# EAGLE design Medir-220-2 (EAGLE 7.2.0)
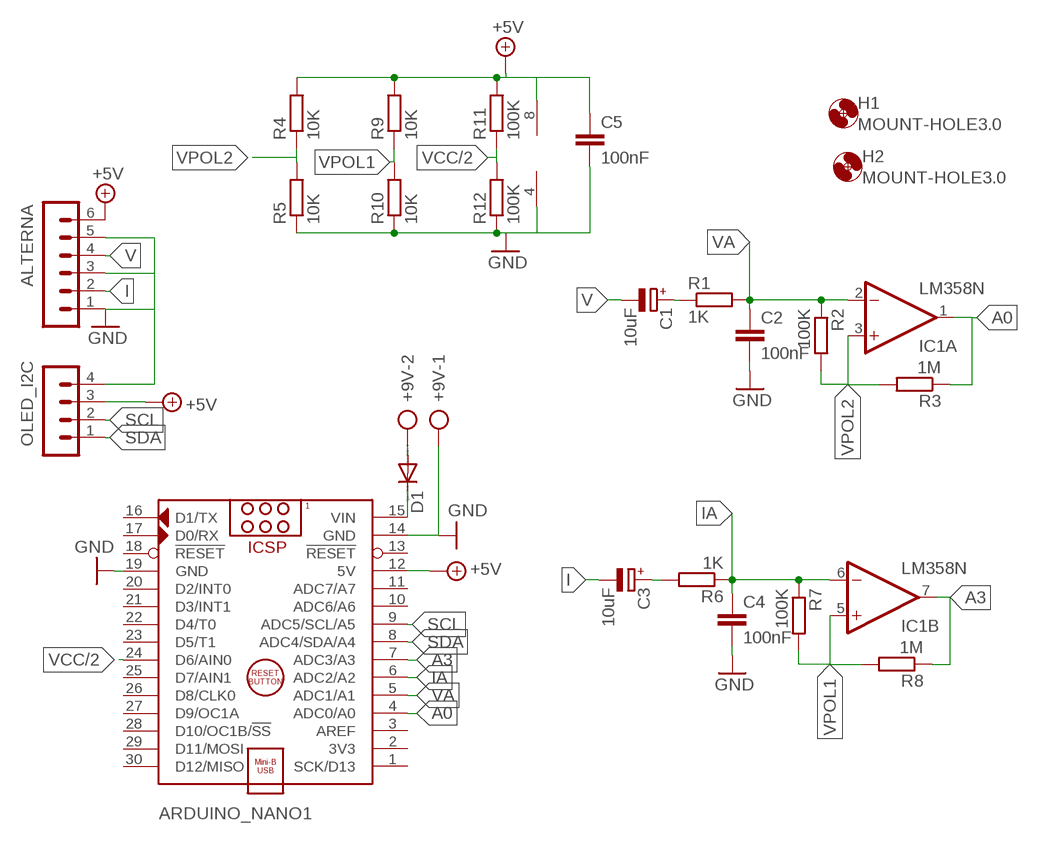
[diagram p0: schematic, sheet 1]

## Parts
+9V  AK500/2  [AK500/2]
ALTERNA  MA06-1  [MA06-1]
ARDUINO_NANO1  ARDUINO_NANO  [ARDUINO_NANO]
C1  10uF  CPOL-EUE2.5-5  [E2,5-5]
C2  100nF  C-EU050-025X075  [C050-025X075]
C3  10uF  CPOL-EUE2.5-5  [E2,5-5]
C4  100nF  C-EU050-025X075  [C050-025X075]
C5  100nF  C-EU025-025X050  [C025-025X050]
D1  DIODE-D-2.5  [D-2.5]
H1  MOUNT-HOLE3.0  [3,0]
H2  MOUNT-HOLE3.0  [3,0]
IC1  LM358N  [DIL08]
OLED_I2C  MA04-1  [MA04-1]
R1  1K  R-EU_0207/7  [0207/7]
R2  100K  R-EU_0207/7  [0207/7]
R3  1M  R-EU_0207/7  [0207/7]
R4  10K  R-EU_0207/10  [0207/10]
R5  10K  R-EU_0207/7  [0207/7]
R6  1K  R-EU_0207/7  [0207/7]
R7  100K  R-EU_0207/7  [0207/7]
R8  1M  R-EU_0207/7  [0207/7]
R9  10K  R-EU_0207/7  [0207/7]
R10  10K  R-EU_0207/7  [0207/7]
R11  100K  R-EU_0207/10  [0207/10]
R12  100K  R-EU_0207/10  [0207/10]

## Nets
+5V: ALTERNA.6 ARDUINO_NANO1.12(5V) C5.1 IC1.8(P:V+) OLED_I2C.3 R4.2 R9.2 R11.2
A0: ARDUINO_NANO1.4(ADC0/A0) IC1.1(A:OUT) R3.1
A3: ARDUINO_NANO1.7(ADC3/A3) IC1.7(B:OUT) R8.1
GND: +9V.1 ALTERNA.1 ALTERNA.3 ALTERNA.5 ARDUINO_NANO1.14(GND) ARDUINO_NANO1.19(GND) C2.2 C4.2 C5.2 IC1.4(P:V-) OLED_I2C.4 R5.1 R10.1 R12.1
I: ALTERNA.2 C3.-
IA: ARDUINO_NANO1.6(ADC2/A2) C4.1 IC1.6(B:-IN) R6.1 R7.1
N$1: C1.+ R1.1
N$2: C3.+ R6.2
N$3: +9V.2 D1.A
N$5: ARDUINO_NANO1.15(VIN) D1.C
SCL: ARDUINO_NANO1.9(ADC5/SCL/A5) OLED_I2C.2
SDA: ARDUINO_NANO1.8(ADC4/SDA/A4) OLED_I2C.1
V: ALTERNA.4 C1.-
VA: ARDUINO_NANO1.5(ADC1/A1) C2.1 IC1.2(A:-IN) R1.2 R2.1
VCC/2: ARDUINO_NANO1.24(D6/AIN0) R11.1 R12.2
VPOL1: IC1.5(B:+IN) R7.2 R8.2 R9.1 R10.2
VPOL2: IC1.3(A:+IN) R2.2 R3.2 R4.1 R5.2
Unconnected: ARDUINO_NANO1.1(SCK/D13) ARDUINO_NANO1.2(3V3) ARDUINO_NANO1.3(AREF) ARDUINO_NANO1.10(ADC6/A6) ARDUINO_NANO1.11(ADC7/A7) ARDUINO_NANO1.13(!RESET) ARDUINO_NANO1.16(D1/TX) ARDUINO_NANO1.17(D0/RX) ARDUINO_NANO1.18(!RESET) ARDUINO_NANO1.20(D2/INT0) ARDUINO_NANO1.21(D3/INT1) ARDUINO_NANO1.22(D4/T0) ARDUINO_NANO1.23(D5/T1) ARDUINO_NANO1.25(D7/AIN1) ARDUINO_NANO1.26(D8/CLK0) ARDUINO_NANO1.27(D9/OC1A) ARDUINO_NANO1.28(D10/OC1B/!SS) ARDUINO_NANO1.29(D11/MOSI) ARDUINO_NANO1.30(D12/MISO)

## Library data of the parts
+9V = con-ptr500:AK500/2: CONNECTOR; OC_FARNELL: unknown; OC_NEWARK: unknown
ALTERNA = con-lstb:MA06-1: PIN HEADER; OC_FARNELL: unknown; OC_NEWARK: unknown
ARDUINO_NANO1 = ArduinoNanoV30:ARDUINO_NANO: Arduino Nano V3.0 Module Overview: The Arduino Nano is a small, complete, and breadboard-friendly board based on the ATmega328 (Arduino Nano 3.x) or ATmega168 (Arduino Nano 2.x). It has more or less the same functionality of the Arduino Duemilanove, but in a different package. It lacks only a DC power jack, and works with a Mini-B USB cable instead of a standard one. The Nano was designed and is being produced by Gravitech <http://www.gravitech.us/arna30wiatp.html>. General specifications: Item Value Microcontroller Atmel ATmega168 or ATmega328 Operating Voltage (logic level) 5 V Input Voltage (recommended) 7-12 V Input Voltage (limits) 6-20 V Digital I/O Pins 14 (of which 6 provide PWM output) Analog Input Pins 8 DC Current per I/O Pin 40 mA Flash Memory 16 KB (ATmega168) or 32 KB (ATmega328) of which 2 KB used by bootloader SRAM 1 KB (ATmega168) or 2 KB (ATmega328) EEPROM 512 bytes (ATmega168) or 1 KB (ATmega328) Clock Speed 16 MHz Dimensions (Inches) 0.73" x 1.70" Dimensions (mm) 18mm x 45mm Overall height About 9 mm (not including pins) Weigth 5 g Power: The Arduino Nano can be powered via the Mini-B USB connection, 6-20V unregulated external power supply (pin 30), or 5V regulated external power supply (pin 27). The power source is automatically selected to the highest voltage source. Memory: The ATmega168 has 16 KB of flash memory for storing code (of which 2 KB is used for the bootloader); the ATmega328 has 32 KB, (also with 2 KB used for the bootloader). The ATmega168 has 1 KB of SRAM and 512 bytes of EEPROM (which can be read and written with the EEPROM library); the ATmega328 has 2 KB of SRAM and 1 KB of EEPROM. Input and Output: Each of the 14 digital pins on the Nano can be used as an input or output, using pinMode(), digitalWrite(), and digitalRead() functions. They operate at 5 volts. Each pin can provide or receive a maximum of 40 mA and has an internal pull-up resistor (disconnected by default) of 20-50 kOhms. In addition, some pins have specialized functions. Visit Arduino - ArduinoBoardNano <https://www.arduino.cc/en/Main/ArduinoBoardNano>
C1 C3 = rcl:CPOL-EU: POLARIZED CAPACITOR, European symbol
C2 C4 C5 = rcl:C-EU: CAPACITOR, European symbol
D1 = diode:DIODE-: DIODE
H1 H2 = holes:MOUNT-HOLE: MOUNTING HOLE with drill center marker
IC1 = linear:LM358: OP AMP also LM158; LM258; LM2904 Source: http://cache.national.com/ds/LM/LM158.pdf
OLED_I2C = con-lstb:MA04-1: PIN HEADER; OC_FARNELL: unknown; OC_NEWARK: unknown
R1-R12 = resistor:R-EU_: RESISTOR, European symbol

## Board
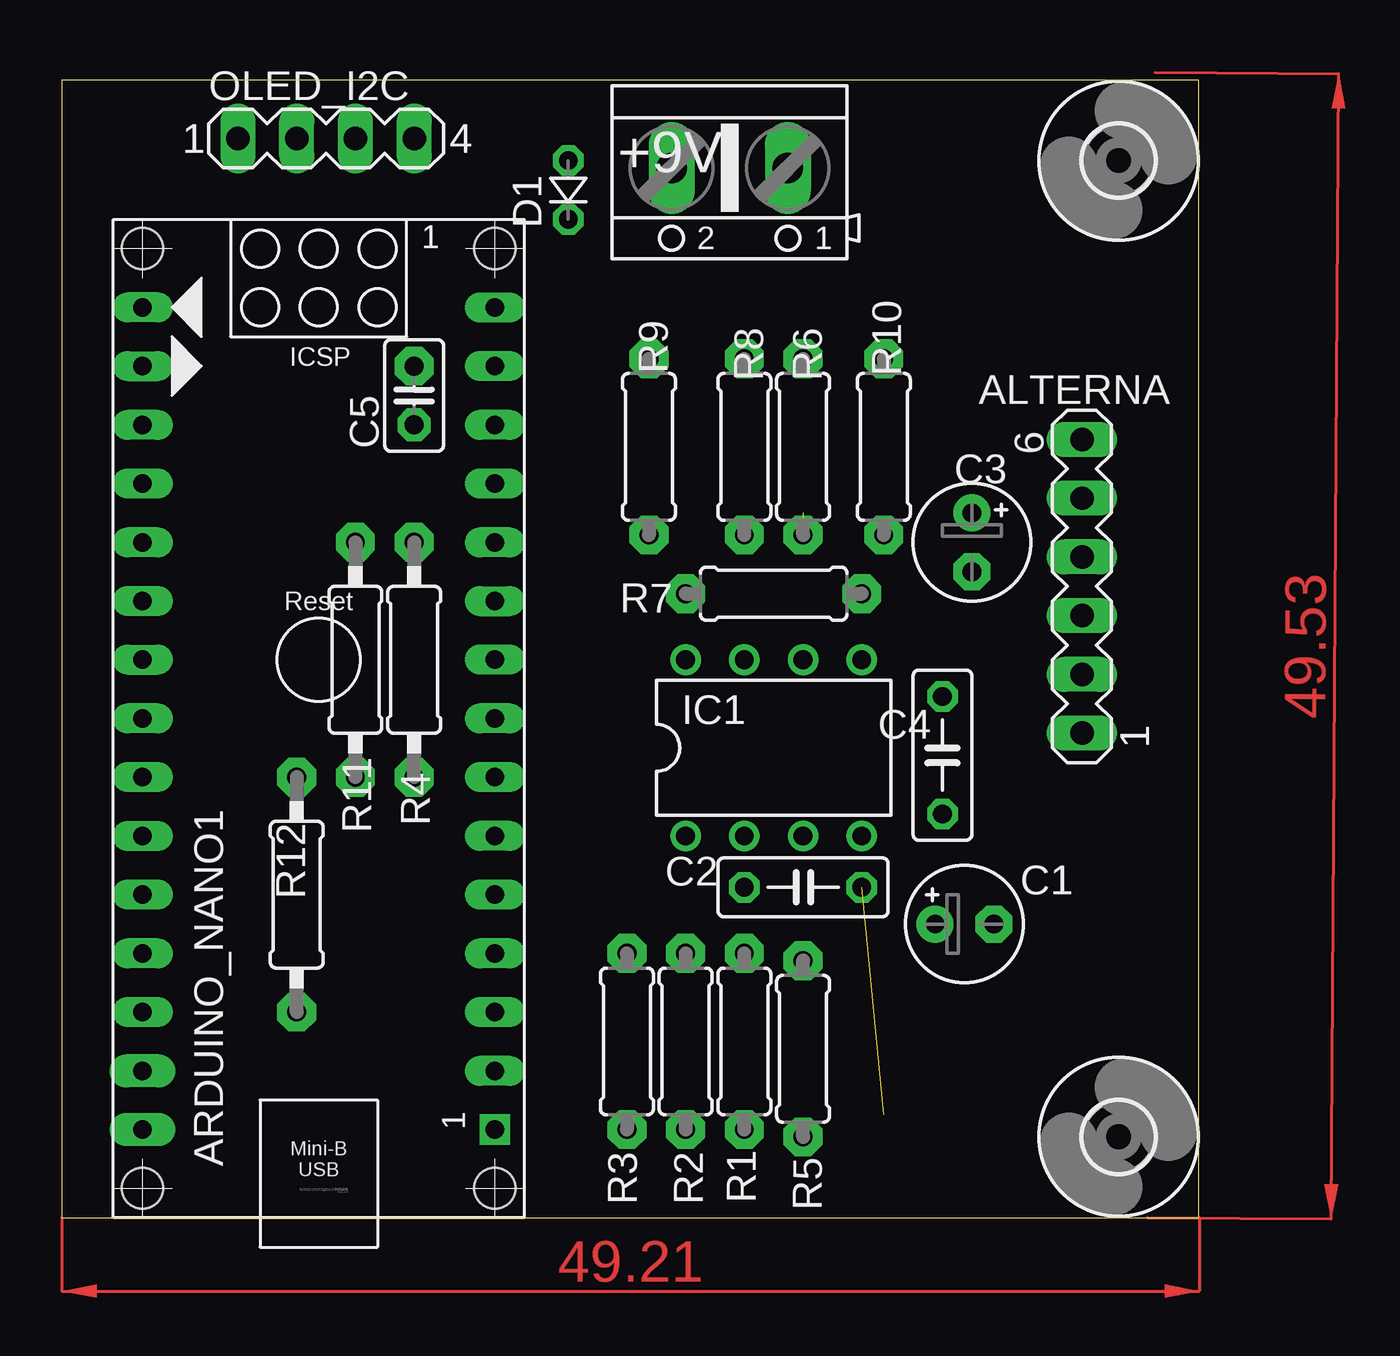
[diagram p1: board, top side]
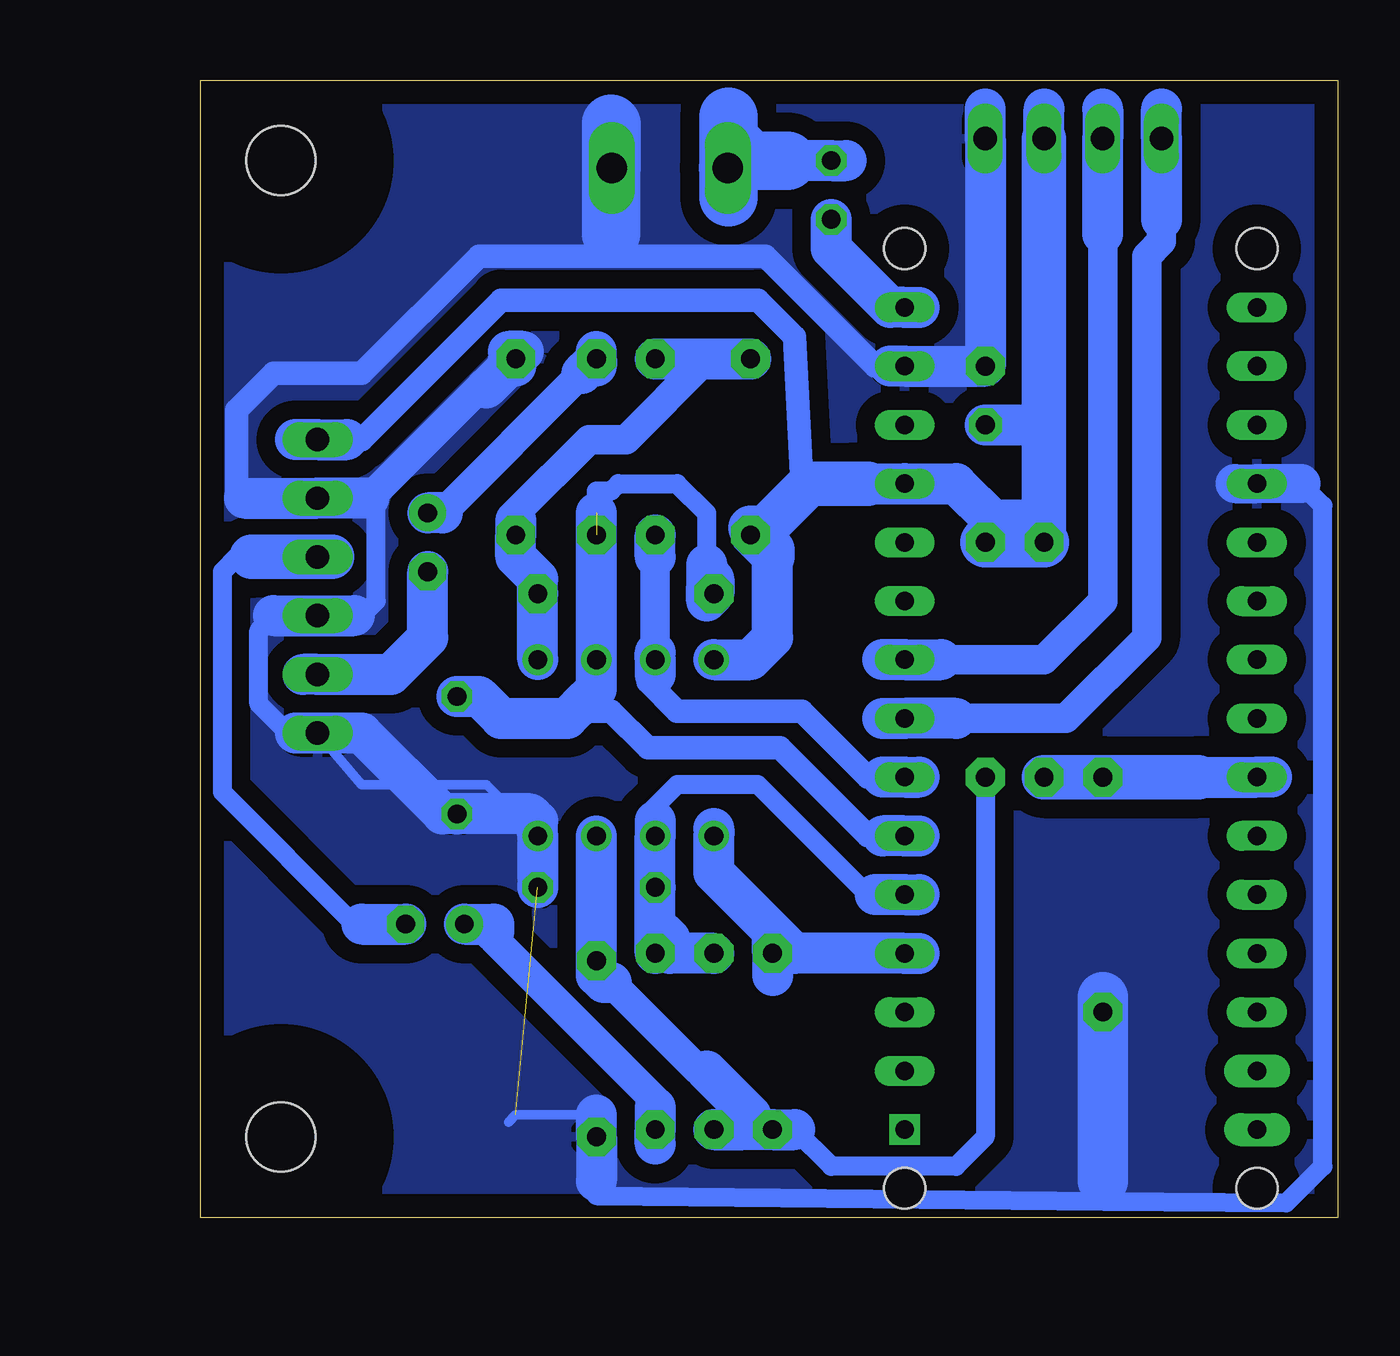
[diagram p2: board, bottom side, seen from below]

Size 49.2 x 49.2 mm. Coordinates in mm from the lower left corner, seen from the top.
Outline: 0,0 49.2,0 49.2,49.2 0,49.2 0,0
Copper layers (1*16): Top 0.035mm / dielectric 1.5mm / Bottom 0.035mm
Design rules "default": minimum track width 10mil, minimum drill 24mil, track to track 8mil, track to pad 8mil, pad to pad 8mil, via to via 8mil, smd to smd 8mil, copper to edge 40mil, drill to drill 8mil, minimum pad ring 10mil, minimum via ring 8mil, stop-mask expansion 4mil, vias tented up to drill 0mil, thermal gap 10mil

### Footprints (pad centres in the part's own frame; a part is rotated, then mirrored left to right if it is on the bottom)
AK500/2 = drill 1.321 long: 1 -2.515,0; 2 2.515,0
MA06-1 = drill 1.016 long: 1 -6.35,0; 2 -3.81,0; 3 -1.27,0; 4 1.27,0; 5 3.81,0; 6 6.35,0
ARDUINO_NANO = drill 0.8 pad 1.27 square: 1 -20.32,-7.62 | drill 0.8 long: 2 -17.78,-7.62; 3 -15.24,-7.62; 4 -12.7,-7.62; 5 -10.16,-7.62; 6 -7.62,-7.62; 7 -5.08,-7.62; 8 -2.54,-7.62; 9 0,-7.62; 10 2.54,-7.62; 11 5.08,-7.62; 12 7.62,-7.62; 13 10.16,-7.62; 14 12.7,-7.62; 15 15.24,-7.62; 16 15.24,7.62; 17 12.7,7.62; 18 10.16,7.62; 19 7.62,7.62; 20 5.08,7.62; 21 2.54,7.62; 22 0,7.62; 23 -2.54,7.62; 24 -5.08,7.62; 25 -7.62,7.62; 26 -10.16,7.62; 27 -12.7,7.62; 28 -15.24,7.62 | drill 0.8 pad 1.422 long: 29 -17.78,7.62; 30 -20.32,7.62 | hole 1.778: -22.86,-7.62; -22.86,7.62; 17.78,7.62; 17.78,-7.62
E2,5-5 = drill 0.813 pad 1.6: + -1.27,0 | drill 0.813 pad 1.6 octagon: - 1.27,0
C050-025X075 = drill 0.813 octagon: 1 -2.54,0; 2 2.54,0
C025-025X050 = drill 0.813 pad 1.422 octagon: 1 -1.27,0 | drill 0.813 pad 1.676 octagon: 2 1.27,0
D-2.5 = drill 0.813 octagon: A 1.27,0; C -1.27,0
3,0 = hole 3: 0,0
DIL08 = drill 0.813 pad 1.27: 1 -3.81,-3.81; 2 -1.27,-3.81; 3 1.27,-3.81; 4 3.81,-3.81; 5 3.81,3.81; 6 1.27,3.81; 7 -1.27,3.81; 8 -3.81,3.81
MA04-1 = drill 1.016 long: 1 -3.81,0; 2 -1.27,0; 3 1.27,0; 4 3.81,0
0207/7 = drill 0.813 pad 1.676 octagon: 1 -3.81,0; 2 3.81,0
0207/10 = drill 0.813 pad 1.676 octagon: 1 -5.08,0; 2 5.08,0

### Placement (x,y rotation side)
+9V  28.89,45.4 180 top
ALTERNA  44.13,27.3 90 top
ARDUINO_NANO1  11.11,24.13 90 top
C1  39.05,12.7 0 top
C2  32.07,14.29 0 top
C3  39.37,29.21 270 top
C4  38.1,20 270 top
C5  15.24,35.56 90 top
D1  21.91,44.45 90 top
H1  45.72,3.49 0 top
H2  45.72,45.72 0 top
IC1  30.8,20.32 0 top
OLED_I2C  11.43,46.67 0 top
R1  29.53,7.62 90 top
R2  26.99,7.62 270 top
R3  24.45,7.62 270 top
R4  15.24,24.13 90 top
R5  32.07,7.3 90 top
R6  32.07,33.34 90 top
R7  30.8,26.99 0 top
R8  29.53,33.34 90 top
R9  25.4,33.34 270 top
R10  35.56,33.34 270 top
R11  12.7,24.13 90 top
R12  10.16,13.97 90 top

### Tracks (layer width: path | path; a pad name or v marks a point on that pad's centre or on a via)
+5V
  Bottom 1.016: 42.86,33.66 42.23,33.66 36.2,39.69 25.08,39.69 23.5,38.1 23.18,31.75 20.95,31.75
  Bottom 1.778: 14.92,30.16 16.51,31.75 ARDUINO_NANO1.12 20.32,31.75 | 14.92,30.16 13.97,29.21 | IC1.8 25.4,24.13 24.45,25.08 24.45,28.57 R9.2 | 45.09,33.66 ALTERNA.6 42.86,33.66 | OLED_I2C.3 12.7,47.94 | 12.7,30.8 13.34,30.16 14.92,30.16 | C5.1 12.7,34.29
  Bottom 1.93: R11.2 12.7,34.29 OLED_I2C.3 | 24.45,28.57 24.45,28.89 25.4,29.85 24.77,29.85 22.86,31.75 20.95,31.75 20.32,31.75
  Bottom 2.184: R11.2 13.97,29.21 R4.2
A0
  Bottom 1.778: 24.45,10.48 R3.1 24.45,12.38 | 24.45,12.38 26.99,14.92 IC1.1 26.99,16.83 | 18.1,11.43 ARDUINO_NANO1.4 23.5,11.43 24.45,12.38
A3
  Bottom 1.016: 19.68,19.05 20.32,19.05 23.18,21.91 28.57,21.91 29.84,23.18 29.84,23.81 IC1.7
  Bottom 1.27: 29.53,24.45 29.53,28.57
  Bottom 1.778: 29.53,23.5 IC1.7 29.53,24.45 | 29.53,28.57 R8.1 | 18.1,19.05 ARDUINO_NANO1.7 19.68,19.05
GND  (1 unrouted)
  Bottom 0.406: IC1.4 36.83,18.73 42.23,18.73 ALTERNA.1 | 32.07,4.45 35.56,4.45 35.88,4.13
  Bottom 0.813: 32.07,1.59 32.07,0.95 10.17,0.72 | 10.17,0.72 2.22,0.64 0.64,2.22 0.64,30.8 1.59,31.75 | 45.09,20.96 45.4,20.96 46.67,22.23 46.67,25.4 46.04,26.04 | 42.55,26.04 42.23,26.04 41.59,26.67 41.59,30.8 41.91,31.11 | 10.16,1.59 10.16,0.73 10.17,0.72
  Bottom 1.016: 19.37,36.83 20,36.83 24.77,41.59 31.11,41.59 | 31.11,41.59 37.15,41.59 42.23,36.51 46.04,36.51 47.62,34.92 47.62,31.43 47.31,31.11 | 31.43,42.54 31.43,41.91 31.11,41.59
  Bottom 1.27: 36.83,35.88 37.15,35.88 41.91,31.11
  Bottom 1.676: 1.59,31.75 ARDUINO_NANO1.19 4.45,31.75
  Bottom 1.778: C2.2 IC1.4 34.61,17.14 34.92,17.46 C4.2 38.73,17.46 42.23,20.96 ALTERNA.1 45.09,20.96 | 46.04,26.04 42.55,26.04 | 41.91,31.11 ALTERNA.5 47.31,31.11 | R10.1 35.24,37.46 35.88,37.46 35.88,37.15 35.56,36.83 35.88,36.83 36.83,35.88 | 32.07,4.45 R5.1 32.07,1.59 | 15.24,47.94 OLED_I2C.4 C5.2 ARDUINO_NANO1.14 19.37,36.83
  Bottom 2.184: 10.16,9.53 R12.1 10.16,1.59
  Bottom 2.54: +9V.1 31.41,47.28 31.43,47.31 31.43,42.54
  pour Bottom (isolate 0.813): 0,0 0,49.21 49.21,49.21 49.21,48.58 49.21,0
I
  Bottom 1.778: 44.77,23.5 ALTERNA.2 40.96,23.5 39.37,25.08 C3.-
IA  (1 unrouted)
  Bottom 0.813: 32.07,30.48 32.07,31.43 31.43,31.43 31.11,31.75 28.57,31.75 27.3,30.48 27.3,28.26
  Bottom 1.016: 19.68,16.51 20.32,16.51 24.13,20.32 29.84,20.32 31.43,21.91 32.7,21.91 32.86,22.07
  Bottom 1.778: C4.1 37.15,22.54 36.2,21.59 33.34,21.59 32.86,22.07 32.07,22.86 IC1.6 32.07,30.48 | 27.3,28.26 27.3,27.94 | 27.3,27.94 26.99,27.62 R7.1 | R7.1 27.3,26.67 27.3,27.3 | 27.3,27.94 27.3,27.3 | 27.3,27.3 R7.1 | 18.1,16.51 ARDUINO_NANO1.6 19.68,16.51
N$1
  Bottom 1.27: 36.51,12.38 36.51,12.06 29.53,5.08 29.53,4.76
  Bottom 1.778: C1.+ 36.51,12.7 36.51,12.38 | 29.53,4.76 R1.1 29.53,3.18
N$2
  Bottom 1.27: 32.7,36.51 38.73,30.48
  Bottom 1.778: 32.07,37.46 R6.2 32.07,36.83 32.38,36.83 32.7,36.51 | 38.73,30.48 C3.+
N$3
  Bottom 1.778: 21.27,45.72 D1.A 23.81,45.72
  Bottom 2.54: 23.81,45.72 25.4,45.72 26.35,46.67 | 26.35,46.67 26.35,47.62 | 26.35,46.67 26.35,45.38 | 26.35,44.13 26.35,45.38 | 26.35,45.38 +9V.2
N$5
  Bottom 1.778: 18.1,39.37 ARDUINO_NANO1.15 19.37,39.37 21.91,41.91 D1.C
SCL
  Bottom 1.27: 17.14,24.13 12.7,24.13 10.16,26.67 10.16,42.54
  Bottom 1.778: 19.68,24.13 ARDUINO_NANO1.9 17.14,24.13 | 10.16,42.54 OLED_I2C.2 10.16,47.94
SDA
  Bottom 1.27: 7.62,43.18 7.62,42.23 8.26,41.59 8.26,25.08 11.75,21.59 16.51,21.59
  Bottom 1.778: 7.62,47.94 OLED_I2C.1 7.62,43.18 | 16.51,21.59 ARDUINO_NANO1.8 19.68,21.59
V
  Bottom 0.813: 46.99,28.57 47.62,28.57 48.26,27.94 48.26,18.42 42.55,12.7 42.23,12.7
  Bottom 1.778: 42.23,12.7 C1.-
  Bottom 1.93: 43.5,28.57 ALTERNA.4 46.99,28.57
VA
  Bottom 0.813: 20,13.97 20.32,13.97 25.08,18.73 28.57,18.73 29.84,17.46 29.53,17.14
  Bottom 1.778: R1.2 29.53,12.7 | 29.53,12.7 C2.1 IC1.2 29.53,17.14 | R2.1 28.89,11.43 28.89,12.06 29.53,12.7 | 18.1,13.97 ARDUINO_NANO1.5 20,13.97
VCC/2
  Bottom 1.778: 6.03,19.05 ARDUINO_NANO1.24 2.86,19.05
  Bottom 1.93: R11.1 R12.2 6.03,19.05
VPOL1
  Bottom 1.27: 35.56,30.16 35.56,30.48 32.38,33.66 30.8,33.66 27.3,37.15
  Bottom 1.778: IC1.5 R7.2 34.61,27.62 35.56,28.57 R10.2 35.56,30.16 | R8.2 27.3,37.15 R9.1
VPOL2
  Bottom 0.813: R4.1 15.24,3.49 16.51,2.22 21.91,2.22 23.5,3.81
  Bottom 1.27: 27.3,6.35 27.62,6.35 31.43,10.16
  Bottom 1.778: 23.5,3.81 R3.2 R2.2 25.72,3.81 25.4,4.13 25.4,4.45 27.3,6.35 | 31.43,10.16 31.75,10.16 32.07,10.48 R5.2 IC1.3
(copper drawn outside any net)
  shapes: Top area x2